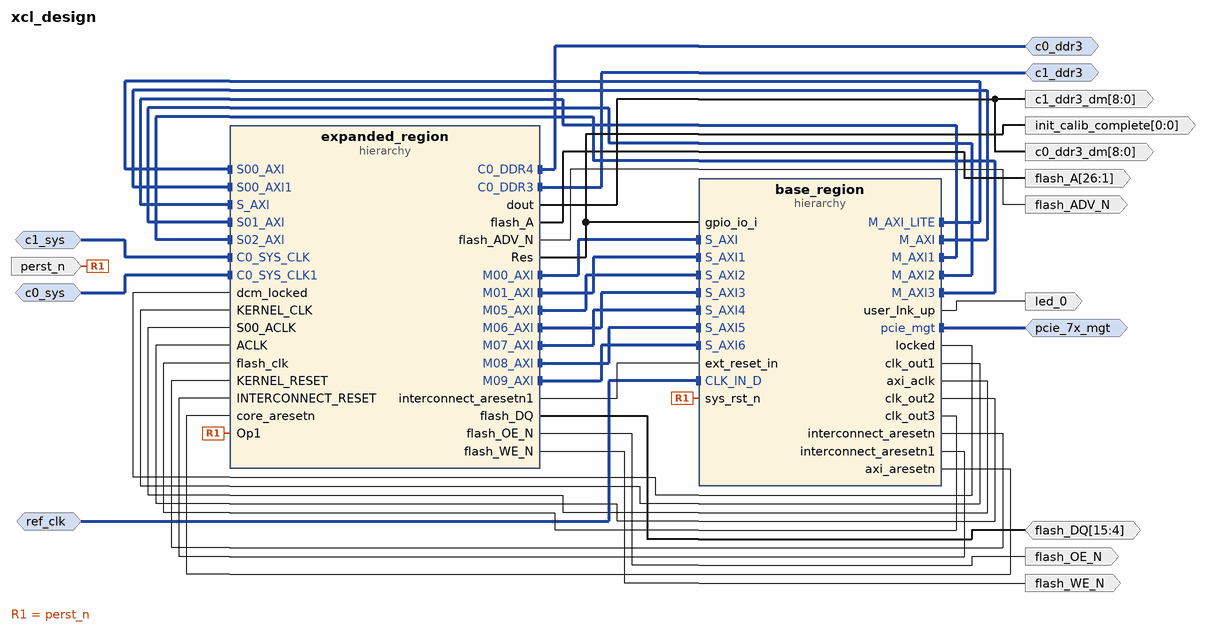
[diagram p0: block diagram of the top level]
# Vivado block design xcl_design, xcku060-ffva1156-2-e, Vivado 2016.3_sdx
create_bd_design xcl_design

create_bd_intf_port -mode Slave -vlnv xilinx.com:interface:diff_clock_rtl:1.0 ref_clk
set_property -dict {CONFIG.FREQ_HZ 100000000} [get_bd_intf_ports ref_clk]
create_bd_intf_port -mode Slave -vlnv xilinx.com:interface:diff_clock_rtl:1.0 c1_sys
set_property -dict {CONFIG.FREQ_HZ 400000000} [get_bd_intf_ports c1_sys]
create_bd_intf_port -mode Slave -vlnv xilinx.com:interface:diff_clock_rtl:1.0 c0_sys
set_property -dict {CONFIG.FREQ_HZ 400000000} [get_bd_intf_ports c0_sys]
create_bd_intf_port -mode Master -vlnv xilinx.com:interface:pcie_7x_mgt_rtl:1.0 pcie_7x_mgt
create_bd_intf_port -mode Master -vlnv xilinx.com:interface:ddrx_rtl:1.0 c1_ddr3
create_bd_intf_port -mode Master -vlnv xilinx.com:interface:ddrx_rtl:1.0 c0_ddr3
create_bd_port -dir I -type rst perst_n
set_property -dict {CONFIG.POLARITY ACTIVE_LOW} [get_bd_ports perst_n]
create_bd_port -dir O -from 8 -to 0 c1_ddr3_dm
create_bd_port -dir O -from 8 -to 0 c0_ddr3_dm
create_bd_port -dir O -from 26 -to 1 flash_A
create_bd_port -dir O flash_ADV_N
create_bd_port -dir IO -from 15 -to 4 flash_DQ
create_bd_port -dir O flash_OE_N
create_bd_port -dir O flash_WE_N
create_bd_port -dir O -from 0 -to 0 init_calib_complete
create_bd_port -dir O led_0

create_bd_cell -type hier base_region
create_bd_cell -type hier expanded_region

# ---- hierarchy /base_region ----
current_bd_instance /base_region
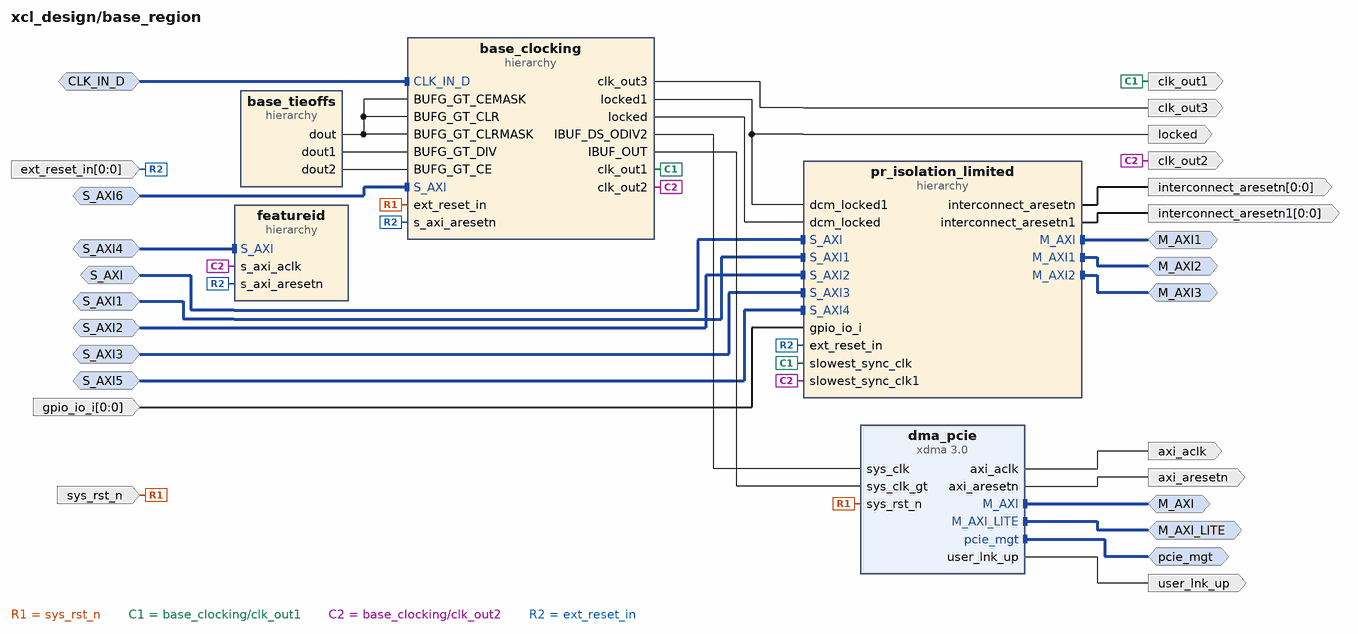
[diagram p1: block diagram inside /base_region]
create_bd_intf_pin -mode Master -vlnv xilinx.com:interface:pcie_7x_mgt_rtl:1.0 pcie_mgt
create_bd_intf_pin -mode Slave -vlnv xilinx.com:interface:diff_clock_rtl:1.0 CLK_IN_D
create_bd_intf_pin -mode Slave -vlnv xilinx.com:interface:aximm_rtl:1.0 S_AXI
create_bd_intf_pin -mode Slave -vlnv xilinx.com:interface:aximm_rtl:1.0 S_AXI1
create_bd_intf_pin -mode Master -vlnv xilinx.com:interface:aximm_rtl:1.0 M_AXI_LITE
create_bd_intf_pin -mode Master -vlnv xilinx.com:interface:aximm_rtl:1.0 M_AXI
create_bd_intf_pin -mode Master -vlnv xilinx.com:interface:aximm_rtl:1.0 M_AXI1
create_bd_intf_pin -mode Master -vlnv xilinx.com:interface:aximm_rtl:1.0 M_AXI2
create_bd_intf_pin -mode Master -vlnv xilinx.com:interface:aximm_rtl:1.0 M_AXI3
create_bd_intf_pin -mode Slave -vlnv xilinx.com:interface:aximm_rtl:1.0 S_AXI2
create_bd_intf_pin -mode Slave -vlnv xilinx.com:interface:aximm_rtl:1.0 S_AXI3
create_bd_intf_pin -mode Slave -vlnv xilinx.com:interface:aximm_rtl:1.0 S_AXI4
create_bd_intf_pin -mode Slave -vlnv xilinx.com:interface:aximm_rtl:1.0 S_AXI5
create_bd_intf_pin -mode Slave -vlnv xilinx.com:interface:aximm_rtl:1.0 S_AXI6
create_bd_pin -dir I -type rst sys_rst_n
create_bd_pin -dir O user_lnk_up
create_bd_pin -dir O locked
create_bd_pin -dir I -from 0 -to 0 gpio_io_i
create_bd_pin -dir O -type clk clk_out1
create_bd_pin -dir O -type clk axi_aclk
create_bd_pin -dir O -type clk clk_out2
create_bd_pin -dir O -type clk clk_out3
create_bd_pin -dir O -from 0 -to 0 -type rst interconnect_aresetn
create_bd_pin -dir O -from 0 -to 0 -type rst interconnect_aresetn1
create_bd_pin -dir O -type rst axi_aresetn
create_bd_pin -dir I -from 0 -to 0 -type rst ext_reset_in

create_bd_cell -type hier base_clocking
create_bd_cell -type hier featureid
create_bd_cell -type hier base_tieoffs
create_bd_cell -type hier pr_isolation_limited
create_bd_cell -type ip -vlnv xilinx.com:ip:xdma:3.0 dma_pcie
set_property -dict [list \
  CONFIG.mode_selection Advanced \
  CONFIG.pl_link_cap_max_link_width X8 \
  CONFIG.pl_link_cap_max_link_speed 8.0_GT/s \
  CONFIG.axi_data_width 256_bit \
  CONFIG.axisten_freq 250 \
  CONFIG.mcap_enablement PR_over_PCIe \
  CONFIG.pf0_device_id 8138 \
  CONFIG.pf0_subsystem_id 0231 \
  CONFIG.axilite_master_en true \
  CONFIG.axilite_master_size 4 \
  CONFIG.xdma_rnum_chnl 2 \
  CONFIG.xdma_wnum_chnl 2 \
  CONFIG.xdma_num_usr_irq 16 \
  CONFIG.cfg_mgmt_if false \
] [get_bd_cells dma_pcie]

# ---- hierarchy /base_region/base_clocking ----
current_bd_instance /base_region/base_clocking
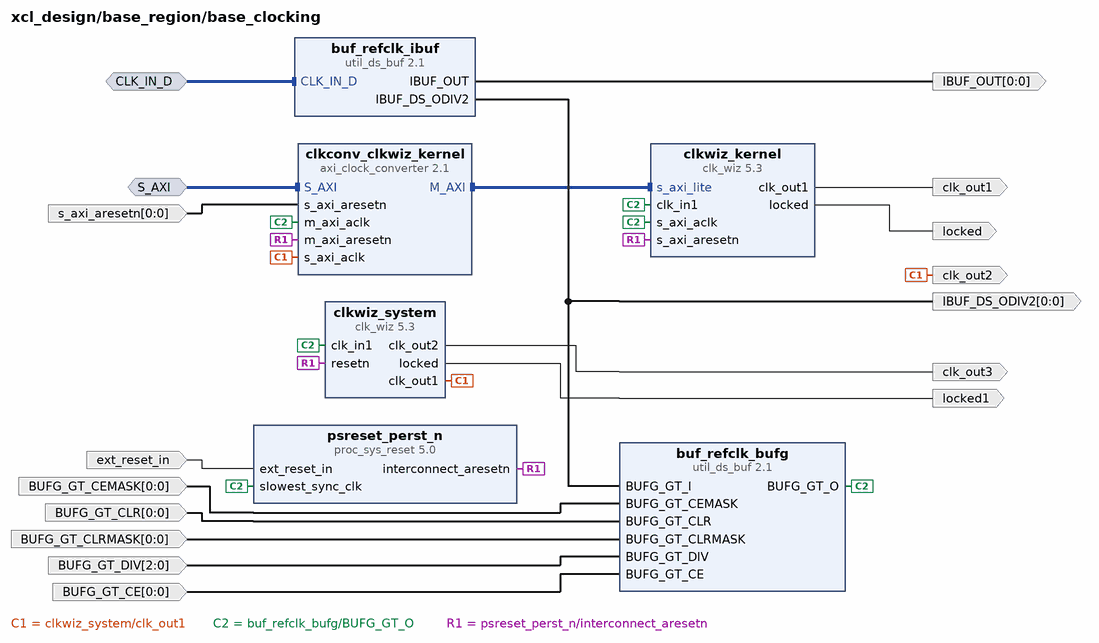
[diagram p2: block diagram inside /base_region/base_clocking]
create_bd_intf_pin -mode Slave -vlnv xilinx.com:interface:diff_clock_rtl:1.0 CLK_IN_D
create_bd_intf_pin -mode Slave -vlnv xilinx.com:interface:aximm_rtl:1.0 S_AXI
create_bd_pin -dir I -type rst ext_reset_in
create_bd_pin -dir O locked
create_bd_pin -dir O locked1
create_bd_pin -dir O -from 0 -to 0 -type clk IBUF_DS_ODIV2
create_bd_pin -dir O -from 0 -to 0 -type clk IBUF_OUT
create_bd_pin -dir I -from 0 -to 0 BUFG_GT_CEMASK
create_bd_pin -dir I -from 0 -to 0 BUFG_GT_CLR
create_bd_pin -dir I -from 0 -to 0 BUFG_GT_CLRMASK
create_bd_pin -dir I -from 2 -to 0 BUFG_GT_DIV
create_bd_pin -dir I -from 0 -to 0 BUFG_GT_CE
create_bd_pin -dir O -type clk clk_out1
create_bd_pin -dir O -type clk clk_out2
create_bd_pin -dir O -type clk clk_out3
create_bd_pin -dir I -from 0 -to 0 -type rst s_axi_aresetn

create_bd_cell -type ip -vlnv xilinx.com:ip:util_ds_buf:2.1 buf_refclk_ibuf
set_property -dict {CONFIG.C_BUF_TYPE IBUFDSGTE} [get_bd_cells buf_refclk_ibuf]
create_bd_cell -type ip -vlnv xilinx.com:ip:util_ds_buf:2.1 buf_refclk_bufg
set_property -dict {CONFIG.C_BUF_TYPE BUFG_GT} [get_bd_cells buf_refclk_bufg]
create_bd_cell -type ip -vlnv xilinx.com:ip:axi_clock_converter:2.1 clkconv_clkwiz_kernel
create_bd_cell -type ip -vlnv xilinx.com:ip:clk_wiz:5.3 clkwiz_kernel
set_property -dict {CONFIG.USE_DYN_RECONFIG true CONFIG.CLKOUT1_REQUESTED_OUT_FREQ 250.000} [get_bd_cells clkwiz_kernel]
create_bd_cell -type ip -vlnv xilinx.com:ip:clk_wiz:5.3 clkwiz_system
set_property -dict [list \
  CONFIG.CLKOUT2_USED true \
  CONFIG.CLKOUT1_REQUESTED_OUT_FREQ 200.000 \
  CONFIG.CLKOUT2_REQUESTED_OUT_FREQ 20.000 \
  CONFIG.PRIM_SOURCE Global_buffer \
  CONFIG.RESET_TYPE ACTIVE_LOW \
] [get_bd_cells clkwiz_system]
create_bd_cell -type ip -vlnv xilinx.com:ip:proc_sys_reset:5.0 psreset_perst_n
set_property -dict {CONFIG.C_AUX_RST_WIDTH 1 CONFIG.C_EXT_RST_WIDTH 1} [get_bd_cells psreset_perst_n]

# ---- hierarchy /base_region/featureid ----
current_bd_instance /base_region/featureid
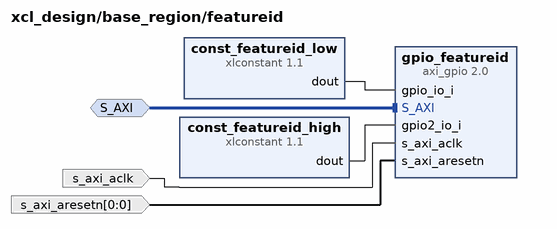
[diagram p3: block diagram inside /base_region/featureid]
create_bd_intf_pin -mode Slave -vlnv xilinx.com:interface:aximm_rtl:1.0 S_AXI
create_bd_pin -dir I -type clk s_axi_aclk
create_bd_pin -dir I -from 0 -to 0 -type rst s_axi_aresetn

create_bd_cell -type ip -vlnv xilinx.com:ip:xlconstant:1.1 const_featureid_high
set_property -dict {CONFIG.CONST_WIDTH 32 CONFIG.CONST_VAL 0} [get_bd_cells const_featureid_high]
create_bd_cell -type ip -vlnv xilinx.com:ip:xlconstant:1.1 const_featureid_low
set_property -dict {CONFIG.CONST_WIDTH 32 CONFIG.CONST_VAL 0} [get_bd_cells const_featureid_low]
create_bd_cell -type ip -vlnv xilinx.com:ip:axi_gpio:2.0 gpio_featureid
set_property -dict {CONFIG.C_IS_DUAL 1 CONFIG.C_ALL_INPUTS 1 CONFIG.C_ALL_INPUTS_2 1} [get_bd_cells gpio_featureid]

# ---- hierarchy /base_region/base_tieoffs ----
current_bd_instance /base_region/base_tieoffs
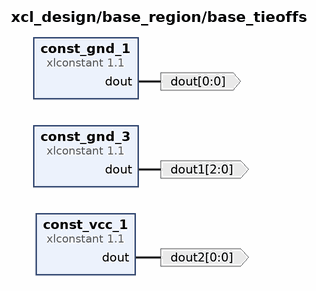
[diagram p4: block diagram inside /base_region/base_tieoffs]
create_bd_pin -dir O -from 0 -to 0 dout
create_bd_pin -dir O -from 2 -to 0 dout1
create_bd_pin -dir O -from 0 -to 0 dout2

create_bd_cell -type ip -vlnv xilinx.com:ip:xlconstant:1.1 const_gnd_1
set_property -dict {CONFIG.CONST_VAL 0} [get_bd_cells const_gnd_1]
create_bd_cell -type ip -vlnv xilinx.com:ip:xlconstant:1.1 const_gnd_3
set_property -dict {CONFIG.CONST_WIDTH 3 CONFIG.CONST_VAL 0} [get_bd_cells const_gnd_3]
create_bd_cell -type ip -vlnv xilinx.com:ip:xlconstant:1.1 const_vcc_1

# ---- hierarchy /base_region/pr_isolation_limited ----
current_bd_instance /base_region/pr_isolation_limited
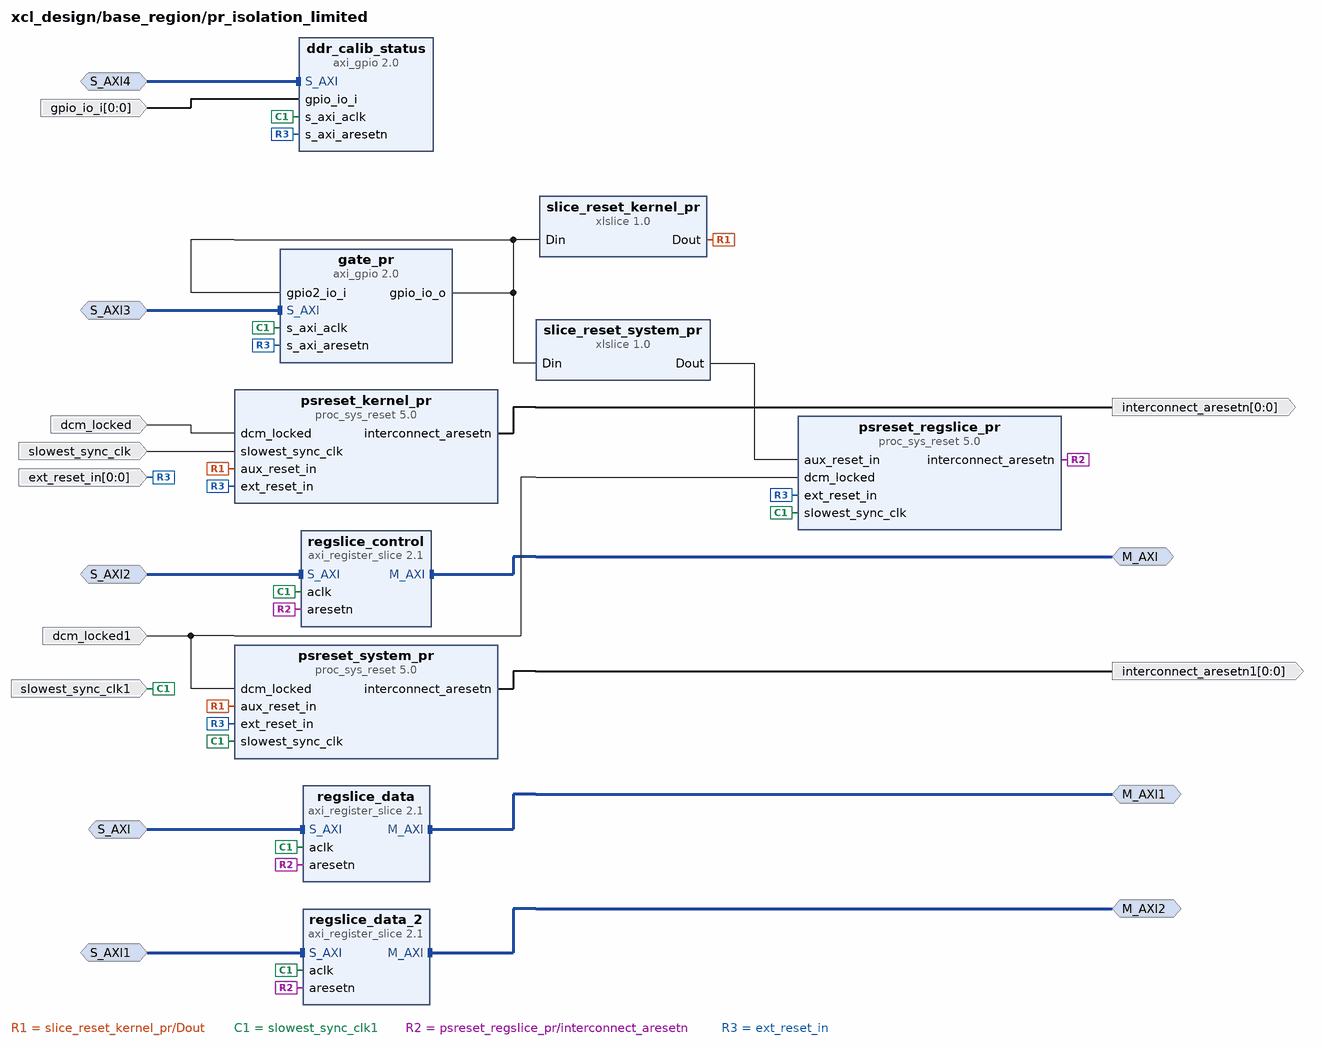
[diagram p5: block diagram inside /base_region/pr_isolation_limited]
create_bd_intf_pin -mode Slave -vlnv xilinx.com:interface:aximm_rtl:1.0 S_AXI
create_bd_intf_pin -mode Slave -vlnv xilinx.com:interface:aximm_rtl:1.0 S_AXI1
create_bd_intf_pin -mode Master -vlnv xilinx.com:interface:aximm_rtl:1.0 M_AXI
create_bd_intf_pin -mode Master -vlnv xilinx.com:interface:aximm_rtl:1.0 M_AXI1
create_bd_intf_pin -mode Master -vlnv xilinx.com:interface:aximm_rtl:1.0 M_AXI2
create_bd_intf_pin -mode Slave -vlnv xilinx.com:interface:aximm_rtl:1.0 S_AXI2
create_bd_intf_pin -mode Slave -vlnv xilinx.com:interface:aximm_rtl:1.0 S_AXI3
create_bd_intf_pin -mode Slave -vlnv xilinx.com:interface:aximm_rtl:1.0 S_AXI4
create_bd_pin -dir I dcm_locked
create_bd_pin -dir I dcm_locked1
create_bd_pin -dir I -from 0 -to 0 gpio_io_i
create_bd_pin -dir I -type clk slowest_sync_clk
create_bd_pin -dir I -type clk slowest_sync_clk1
create_bd_pin -dir O -from 0 -to 0 -type rst interconnect_aresetn
create_bd_pin -dir O -from 0 -to 0 -type rst interconnect_aresetn1
create_bd_pin -dir I -from 0 -to 0 -type rst ext_reset_in

create_bd_cell -type ip -vlnv xilinx.com:ip:xlslice:1.0 slice_reset_kernel_pr
set_property -dict {CONFIG.DIN_TO 1 CONFIG.DIN_FROM 1 CONFIG.DIN_WIDTH 2} [get_bd_cells slice_reset_kernel_pr]
create_bd_cell -type ip -vlnv xilinx.com:ip:xlslice:1.0 slice_reset_system_pr
set_property -dict {CONFIG.DIN_TO 0 CONFIG.DIN_FROM 0 CONFIG.DIN_WIDTH 2} [get_bd_cells slice_reset_system_pr]
create_bd_cell -type ip -vlnv xilinx.com:ip:axi_gpio:2.0 ddr_calib_status
set_property -dict {CONFIG.C_GPIO_WIDTH 1 CONFIG.C_ALL_INPUTS 1} [get_bd_cells ddr_calib_status]
create_bd_cell -type ip -vlnv xilinx.com:ip:axi_gpio:2.0 gate_pr
set_property -dict [list \
  CONFIG.C_GPIO_WIDTH 2 \
  CONFIG.C_GPIO2_WIDTH 2 \
  CONFIG.C_IS_DUAL 1 \
  CONFIG.C_DOUT_DEFAULT 0xFFFFFFFF \
  CONFIG.C_ALL_INPUTS_2 1 \
  CONFIG.C_ALL_OUTPUTS 1 \
] [get_bd_cells gate_pr]
create_bd_cell -type ip -vlnv xilinx.com:ip:proc_sys_reset:5.0 psreset_kernel_pr
set_property -dict {CONFIG.C_AUX_RST_WIDTH 1 CONFIG.C_EXT_RST_WIDTH 1} [get_bd_cells psreset_kernel_pr]
create_bd_cell -type ip -vlnv xilinx.com:ip:proc_sys_reset:5.0 psreset_regslice_pr
set_property -dict {CONFIG.C_AUX_RST_WIDTH 1 CONFIG.C_EXT_RST_WIDTH 1} [get_bd_cells psreset_regslice_pr]
create_bd_cell -type ip -vlnv xilinx.com:ip:proc_sys_reset:5.0 psreset_system_pr
set_property -dict {CONFIG.C_AUX_RST_WIDTH 1 CONFIG.C_EXT_RST_WIDTH 1} [get_bd_cells psreset_system_pr]
create_bd_cell -type ip -vlnv xilinx.com:ip:axi_register_slice:2.1 regslice_control
create_bd_cell -type ip -vlnv xilinx.com:ip:axi_register_slice:2.1 regslice_data
set_property -dict [list \
  CONFIG.PROTOCOL AXI4 \
  CONFIG.READ_WRITE_MODE READ_WRITE \
  CONFIG.ADDR_WIDTH 38 \
  CONFIG.DATA_WIDTH 512 \
  CONFIG.ID_WIDTH 4 \
] [get_bd_cells regslice_data]
create_bd_cell -type ip -vlnv xilinx.com:ip:axi_register_slice:2.1 regslice_data_2
set_property -dict [list \
  CONFIG.PROTOCOL AXI4 \
  CONFIG.READ_WRITE_MODE READ_WRITE \
  CONFIG.ADDR_WIDTH 38 \
  CONFIG.DATA_WIDTH 512 \
  CONFIG.ID_WIDTH 4 \
] [get_bd_cells regslice_data_2]

# ---- hierarchy /expanded_region ----
current_bd_instance /expanded_region
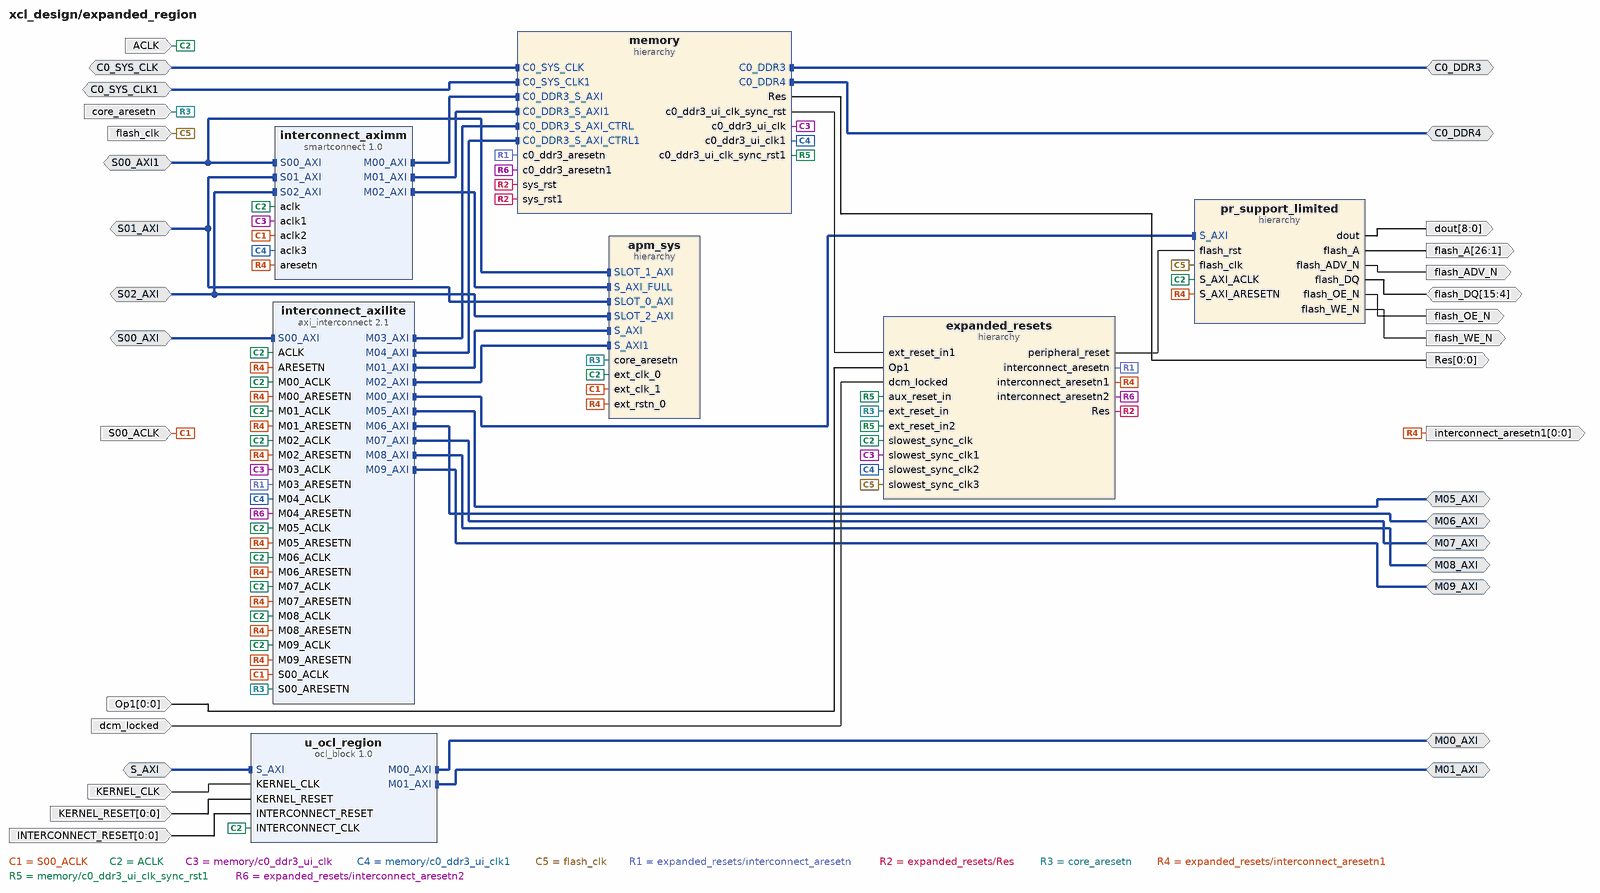
[diagram p6: block diagram inside /expanded_region]
create_bd_intf_pin -mode Slave -vlnv xilinx.com:interface:diff_clock_rtl:1.0 C0_SYS_CLK
create_bd_intf_pin -mode Master -vlnv xilinx.com:interface:ddrx_rtl:1.0 C0_DDR3
create_bd_intf_pin -mode Slave -vlnv xilinx.com:interface:diff_clock_rtl:1.0 C0_SYS_CLK1
create_bd_intf_pin -mode Master -vlnv xilinx.com:interface:ddrx_rtl:1.0 C0_DDR4
create_bd_intf_pin -mode Master -vlnv xilinx.com:interface:aximm_rtl:1.0 M00_AXI
create_bd_intf_pin -mode Master -vlnv xilinx.com:interface:aximm_rtl:1.0 M01_AXI
create_bd_intf_pin -mode Slave -vlnv xilinx.com:interface:aximm_rtl:1.0 S00_AXI
create_bd_intf_pin -mode Slave -vlnv xilinx.com:interface:aximm_rtl:1.0 S00_AXI1
create_bd_intf_pin -mode Slave -vlnv xilinx.com:interface:aximm_rtl:1.0 S_AXI
create_bd_intf_pin -mode Slave -vlnv xilinx.com:interface:aximm_rtl:1.0 S01_AXI
create_bd_intf_pin -mode Slave -vlnv xilinx.com:interface:aximm_rtl:1.0 S02_AXI
create_bd_intf_pin -mode Master -vlnv xilinx.com:interface:aximm_rtl:1.0 M05_AXI
create_bd_intf_pin -mode Master -vlnv xilinx.com:interface:aximm_rtl:1.0 M06_AXI
create_bd_intf_pin -mode Master -vlnv xilinx.com:interface:aximm_rtl:1.0 M07_AXI
create_bd_intf_pin -mode Master -vlnv xilinx.com:interface:aximm_rtl:1.0 M08_AXI
create_bd_intf_pin -mode Master -vlnv xilinx.com:interface:aximm_rtl:1.0 M09_AXI
create_bd_pin -dir I -from 0 -to 0 Op1
create_bd_pin -dir O -from 8 -to 0 dout
create_bd_pin -dir O -from 26 -to 1 flash_A
create_bd_pin -dir O flash_ADV_N
create_bd_pin -dir IO -from 15 -to 4 flash_DQ
create_bd_pin -dir O flash_OE_N
create_bd_pin -dir O flash_WE_N
create_bd_pin -dir O -from 0 -to 0 Res
create_bd_pin -dir I dcm_locked
create_bd_pin -dir I -type clk KERNEL_CLK
create_bd_pin -dir I -type clk S00_ACLK
create_bd_pin -dir I -type clk ACLK
create_bd_pin -dir I -type clk flash_clk
create_bd_pin -dir I -from 0 -to 0 -type rst KERNEL_RESET
create_bd_pin -dir I -from 0 -to 0 -type rst INTERCONNECT_RESET
create_bd_pin -dir I -type rst core_aresetn
create_bd_pin -dir O -from 0 -to 0 -type rst interconnect_aresetn1

create_bd_cell -type hier expanded_resets
create_bd_cell -type hier memory
create_bd_cell -type hier pr_support_limited
create_bd_cell -type hier apm_sys
create_bd_cell -type ip -vlnv xilinx.com:ip:axi_interconnect:2.1 interconnect_axilite
set_property -dict [list \
  CONFIG.NUM_MI 10 \
  CONFIG.M00_HAS_REGSLICE 4 \
  CONFIG.M01_HAS_REGSLICE 4 \
  CONFIG.M02_HAS_REGSLICE 4 \
  CONFIG.M03_HAS_REGSLICE 4 \
  CONFIG.M04_HAS_REGSLICE 4 \
  CONFIG.M05_HAS_REGSLICE 4 \
  CONFIG.M06_HAS_REGSLICE 4 \
  CONFIG.M07_HAS_REGSLICE 4 \
  CONFIG.M08_HAS_REGSLICE 4 \
  CONFIG.M09_HAS_REGSLICE 4 \
  CONFIG.S00_HAS_REGSLICE 4 \
] [get_bd_cells interconnect_axilite]
create_bd_cell -type ip -vlnv xilinx.com:ip:smartconnect:1.0 interconnect_aximm
set_property -dict {CONFIG.NUM_MI 3 CONFIG.NUM_SI 3 CONFIG.NUM_CLKS 4} [get_bd_cells interconnect_aximm]
create_bd_cell -type ip -vlnv xilinx.com:ip:ocl_block:1.0 u_ocl_region
set_property -dict [list \
  CONFIG.M_DATA_WIDTH 512 \
  CONFIG.M_ADDR_WIDTH 38 \
  CONFIG.M_ID_WIDTH 4 \
  CONFIG.S_ADDR_WIDTH 17 \
  CONFIG.USE_PR true \
  CONFIG.SYNC_RESET true \
  CONFIG.NUM_MI 2 \
  CONFIG.NUM_KERNELS 2 \
  CONFIG.KERNEL_TYPE ADD_ONE \
  CONFIG.HAS_KERNEL_CLOCK true \
  CONFIG.HAS_S_MEM false \
  CONFIG.NUM_M_AXIS_RX 0 \
  CONFIG.NUM_S_AXIS_TX 0 \
  CONFIG.BOUNDARY_VERSION 2 \
  CONFIG.ENABLE_SMARTCONNECT false \
  CONFIG.M_HAS_REGSLICE 4 \
  CONFIG.S_HAS_REGSLICE 4 \
] [get_bd_cells u_ocl_region]

# ---- hierarchy /expanded_region/expanded_resets ----
current_bd_instance /expanded_region/expanded_resets
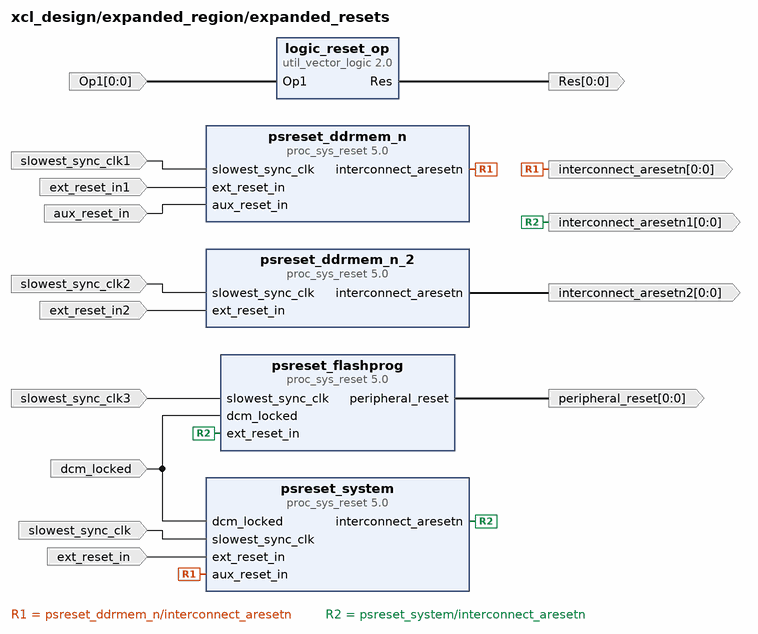
[diagram p7: block diagram inside /expanded_region/expanded_resets]
create_bd_pin -dir I -from 0 -to 0 Op1
create_bd_pin -dir I dcm_locked
create_bd_pin -dir I -type clk slowest_sync_clk
create_bd_pin -dir I -type clk slowest_sync_clk1
create_bd_pin -dir I -type clk slowest_sync_clk2
create_bd_pin -dir I -type clk slowest_sync_clk3
create_bd_pin -dir O -from 0 -to 0 -type rst interconnect_aresetn
create_bd_pin -dir O -from 0 -to 0 Res
create_bd_pin -dir I -type rst ext_reset_in
create_bd_pin -dir O -from 0 -to 0 -type rst interconnect_aresetn1
create_bd_pin -dir I -type rst ext_reset_in1
create_bd_pin -dir O -from 0 -to 0 -type rst peripheral_reset
create_bd_pin -dir I -type rst aux_reset_in
create_bd_pin -dir I -type rst ext_reset_in2
create_bd_pin -dir O -from 0 -to 0 -type rst interconnect_aresetn2

create_bd_cell -type ip -vlnv xilinx.com:ip:util_vector_logic:2.0 logic_reset_op
set_property -dict {CONFIG.C_SIZE 1 CONFIG.C_OPERATION not} [get_bd_cells logic_reset_op]
create_bd_cell -type ip -vlnv xilinx.com:ip:proc_sys_reset:5.0 psreset_ddrmem_n
create_bd_cell -type ip -vlnv xilinx.com:ip:proc_sys_reset:5.0 psreset_ddrmem_n_2
create_bd_cell -type ip -vlnv xilinx.com:ip:proc_sys_reset:5.0 psreset_flashprog
set_property -dict {CONFIG.C_AUX_RST_WIDTH 1 CONFIG.C_EXT_RST_WIDTH 1} [get_bd_cells psreset_flashprog]
create_bd_cell -type ip -vlnv xilinx.com:ip:proc_sys_reset:5.0 psreset_system
set_property -dict {CONFIG.C_AUX_RST_WIDTH 1 CONFIG.C_EXT_RST_WIDTH 1} [get_bd_cells psreset_system]

# ---- hierarchy /expanded_region/memory ----
current_bd_instance /expanded_region/memory
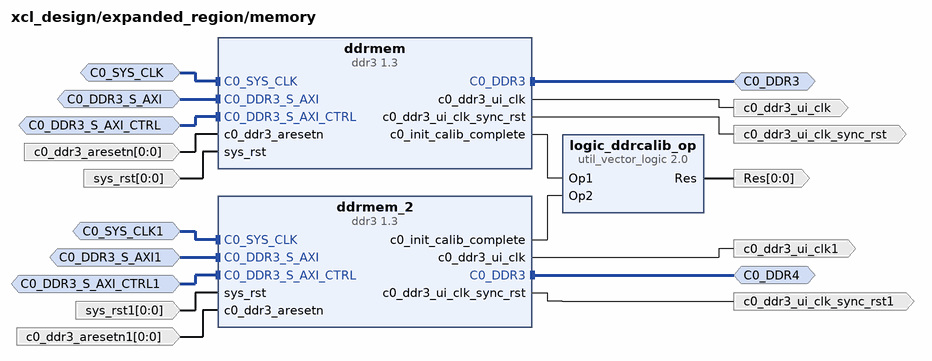
[diagram p8: block diagram inside /expanded_region/memory]
create_bd_intf_pin -mode Slave -vlnv xilinx.com:interface:diff_clock_rtl:1.0 C0_SYS_CLK
create_bd_intf_pin -mode Master -vlnv xilinx.com:interface:ddrx_rtl:1.0 C0_DDR3
create_bd_intf_pin -mode Slave -vlnv xilinx.com:interface:diff_clock_rtl:1.0 C0_SYS_CLK1
create_bd_intf_pin -mode Master -vlnv xilinx.com:interface:ddrx_rtl:1.0 C0_DDR4
create_bd_intf_pin -mode Slave -vlnv xilinx.com:interface:aximm_rtl:1.0 C0_DDR3_S_AXI
create_bd_intf_pin -mode Slave -vlnv xilinx.com:interface:aximm_rtl:1.0 C0_DDR3_S_AXI1
create_bd_intf_pin -mode Slave -vlnv xilinx.com:interface:aximm_rtl:1.0 C0_DDR3_S_AXI_CTRL
create_bd_intf_pin -mode Slave -vlnv xilinx.com:interface:aximm_rtl:1.0 C0_DDR3_S_AXI_CTRL1
create_bd_pin -dir O -from 0 -to 0 Res
create_bd_pin -dir O -type clk c0_ddr3_ui_clk
create_bd_pin -dir O -type clk c0_ddr3_ui_clk1
create_bd_pin -dir I -from 0 -to 0 -type rst c0_ddr3_aresetn
create_bd_pin -dir I -from 0 -to 0 -type rst sys_rst
create_bd_pin -dir I -from 0 -to 0 -type rst sys_rst1
create_bd_pin -dir O -type rst c0_ddr3_ui_clk_sync_rst
create_bd_pin -dir O -type rst c0_ddr3_ui_clk_sync_rst1
create_bd_pin -dir I -from 0 -to 0 -type rst c0_ddr3_aresetn1

create_bd_cell -type ip -vlnv xilinx.com:ip:util_vector_logic:2.0 logic_ddrcalib_op
set_property -dict {CONFIG.C_SIZE 1 CONFIG.C_OPERATION and} [get_bd_cells logic_ddrcalib_op]
create_bd_cell -type ip -vlnv xilinx.com:ip:ddr3:1.3 ddrmem
set_property -dict [list \
  CONFIG.C0.DDR3_TimePeriod 1250 \
  CONFIG.C0.DDR3_InputClockPeriod 2500 \
  CONFIG.C0.DDR3_MemoryType SODIMMs \
  CONFIG.C0.DDR3_MemoryPart MT18KSF1G72HZ-1G6 \
  CONFIG.C0.DDR3_DataWidth 72 \
  CONFIG.C0.DDR3_OnDieTermination RZQ/6 \
  CONFIG.C0.DDR3_CasLatency 11 \
  CONFIG.C0.DDR3_CasWriteLatency 8 \
  CONFIG.C0.DDR3_AxiDataWidth 512 \
  CONFIG.C0.DDR3_AxiAddressWidth 33 \
] [get_bd_cells ddrmem]
create_bd_cell -type ip -vlnv xilinx.com:ip:ddr3:1.3 ddrmem_2
set_property -dict [list \
  CONFIG.C0.DDR3_TimePeriod 1250 \
  CONFIG.C0.DDR3_InputClockPeriod 2500 \
  CONFIG.C0.DDR3_MemoryType SODIMMs \
  CONFIG.C0.DDR3_MemoryPart MT18KSF1G72HZ-1G6 \
  CONFIG.C0.DDR3_DataWidth 72 \
  CONFIG.C0.DDR3_OnDieTermination RZQ/6 \
  CONFIG.C0.DDR3_CasLatency 11 \
  CONFIG.C0.DDR3_CasWriteLatency 8 \
  CONFIG.C0.DDR3_AxiDataWidth 512 \
  CONFIG.C0.DDR3_AxiAddressWidth 33 \
] [get_bd_cells ddrmem_2]

# ---- hierarchy /expanded_region/pr_support_limited ----
current_bd_instance /expanded_region/pr_support_limited
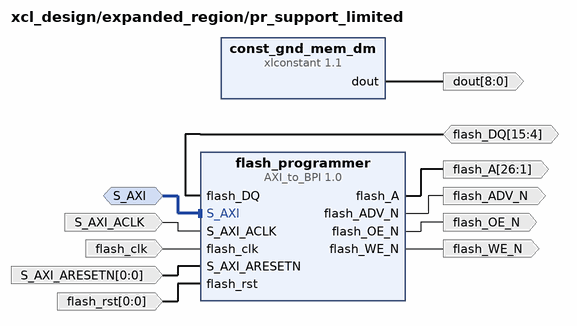
[diagram p9: block diagram inside /expanded_region/pr_support_limited]
create_bd_intf_pin -mode Slave -vlnv xilinx.com:interface:aximm_rtl:1.0 S_AXI
create_bd_pin -dir O -from 8 -to 0 dout
create_bd_pin -dir O -from 26 -to 1 flash_A
create_bd_pin -dir O flash_ADV_N
create_bd_pin -dir IO -from 15 -to 4 flash_DQ
create_bd_pin -dir O flash_OE_N
create_bd_pin -dir O flash_WE_N
create_bd_pin -dir I -type clk S_AXI_ACLK
create_bd_pin -dir I -type clk flash_clk
create_bd_pin -dir I -from 0 -to 0 -type rst S_AXI_ARESETN
create_bd_pin -dir I -from 0 -to 0 -type rst flash_rst

create_bd_cell -type ip -vlnv xilinx.com:ip:xlconstant:1.1 const_gnd_mem_dm
set_property -dict {CONFIG.CONST_WIDTH 9 CONFIG.CONST_VAL 0} [get_bd_cells const_gnd_mem_dm]
create_bd_cell -type ip -vlnv xilinx.com:user:AXI_to_BPI:1.0 flash_programmer

# ---- hierarchy /expanded_region/apm_sys ----
current_bd_instance /expanded_region/apm_sys
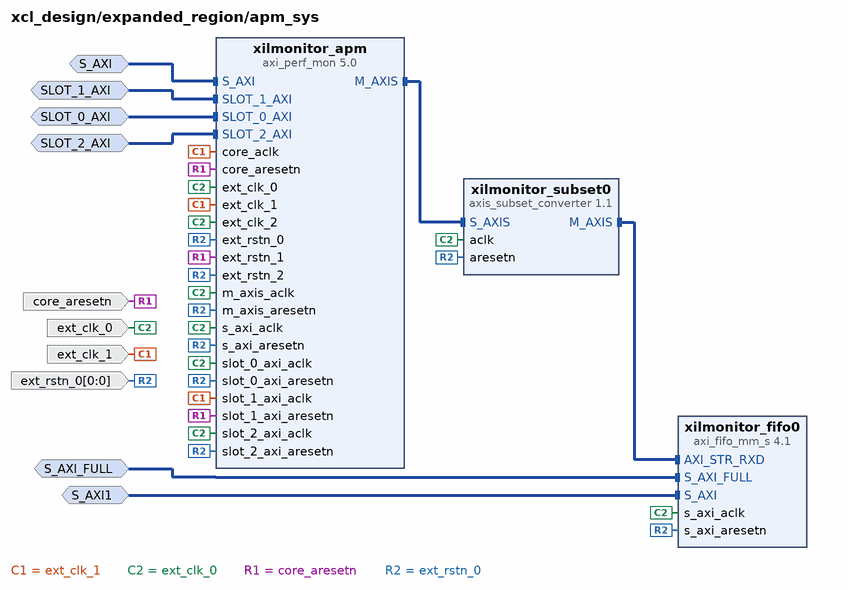
[diagram p10: block diagram inside /expanded_region/apm_sys]
create_bd_intf_pin -mode Monitor -vlnv xilinx.com:interface:aximm_rtl:1.0 SLOT_1_AXI
create_bd_intf_pin -mode Monitor -vlnv xilinx.com:interface:aximm_rtl:1.0 SLOT_0_AXI
create_bd_intf_pin -mode Monitor -vlnv xilinx.com:interface:aximm_rtl:1.0 SLOT_2_AXI
create_bd_intf_pin -mode Slave -vlnv xilinx.com:interface:aximm_rtl:1.0 S_AXI_FULL
create_bd_intf_pin -mode Slave -vlnv xilinx.com:interface:aximm_rtl:1.0 S_AXI
create_bd_intf_pin -mode Slave -vlnv xilinx.com:interface:aximm_rtl:1.0 S_AXI1
create_bd_pin -dir I -type clk ext_clk_1
create_bd_pin -dir I -type clk ext_clk_0
create_bd_pin -dir I -type rst core_aresetn
create_bd_pin -dir I -from 0 -to 0 -type rst ext_rstn_0

create_bd_cell -type ip -vlnv xilinx.com:ip:axi_perf_mon:5.0 xilmonitor_apm
set_property -dict [list \
  CONFIG.C_FIFO_AXIS_DEPTH 16 \
  CONFIG.C_REG_ALL_MONITOR_SIGNALS 1 \
  CONFIG.C_SLOT_1_AXI_ID_WIDTH 5 \
  CONFIG.C_NUM_MONITOR_SLOTS 3 \
  CONFIG.C_SHOW_AXI_IDS 0 \
  CONFIG.C_SHOW_AXI_LEN 1 \
  CONFIG.C_ENABLE_PROFILE 1 \
  CONFIG.C_ENABLE_TRACE 1 \
  CONFIG.C_EN_WR_ADD_FLAG 1 \
  CONFIG.C_EN_FIRST_WRITE_FLAG 0 \
  CONFIG.C_EN_LAST_WRITE_FLAG 1 \
  CONFIG.C_EN_RESPONSE_FLAG 0 \
  CONFIG.C_EN_RD_ADD_FLAG 1 \
  CONFIG.C_EN_FIRST_READ_FLAG 0 \
  CONFIG.C_EN_LAST_READ_FLAG 1 \
  CONFIG.C_EN_EXT_EVENTS_FLAG 1 \
  CONFIG.C_EN_SW_REG_WR_FLAG 1 \
] [get_bd_cells xilmonitor_apm]
create_bd_cell -type ip -vlnv xilinx.com:ip:axi_fifo_mm_s:4.1 xilmonitor_fifo0
set_property -dict [list \
  CONFIG.C_DATA_INTERFACE_TYPE 1 \
  CONFIG.C_RX_FIFO_PF_THRESHOLD 4091 \
  CONFIG.C_RX_FIFO_DEPTH 4096 \
  CONFIG.C_S_AXI4_DATA_WIDTH 128 \
  CONFIG.C_AXIS_TUSER_WIDTH 16 \
  CONFIG.C_USE_RX_CUT_THROUGH true \
  CONFIG.C_USE_TX_DATA 0 \
] [get_bd_cells xilmonitor_fifo0]
create_bd_cell -type ip -vlnv xilinx.com:ip:axis_subset_converter:1.1 xilmonitor_subset0
set_property -dict [list \
  CONFIG.S_TDATA_NUM_BYTES 12 \
  CONFIG.M_TDATA_NUM_BYTES 16 \
  CONFIG.TDATA_REMAP {32'b00000000000000000000000000000000,tdata[95:0]} \
] [get_bd_cells xilmonitor_subset0]

# ---- connections ----

current_bd_instance /base_region
connect_bd_intf_net [get_bd_intf_pins pcie_mgt] [get_bd_intf_pins dma_pcie/pcie_mgt]
connect_bd_intf_net [get_bd_intf_pins CLK_IN_D] [get_bd_intf_pins base_clocking/CLK_IN_D]
connect_bd_intf_net [get_bd_intf_pins S_AXI] [get_bd_intf_pins pr_isolation_limited/S_AXI]
connect_bd_intf_net -intf_net S_AXI1_1 [get_bd_intf_pins S_AXI1] [get_bd_intf_pins pr_isolation_limited/S_AXI1]
connect_bd_intf_net [get_bd_intf_pins M_AXI_LITE] [get_bd_intf_pins dma_pcie/M_AXI_LITE]
connect_bd_intf_net [get_bd_intf_pins M_AXI] [get_bd_intf_pins dma_pcie/M_AXI]
connect_bd_intf_net [get_bd_intf_pins M_AXI1] [get_bd_intf_pins pr_isolation_limited/M_AXI]
connect_bd_intf_net [get_bd_intf_pins M_AXI2] [get_bd_intf_pins pr_isolation_limited/M_AXI1]
connect_bd_intf_net [get_bd_intf_pins M_AXI3] [get_bd_intf_pins pr_isolation_limited/M_AXI2]
connect_bd_intf_net -intf_net S_AXI2_1 [get_bd_intf_pins S_AXI2] [get_bd_intf_pins pr_isolation_limited/S_AXI2]
connect_bd_intf_net -intf_net S_AXI3_1 [get_bd_intf_pins S_AXI3] [get_bd_intf_pins pr_isolation_limited/S_AXI3]
connect_bd_intf_net -intf_net S_AXI4_1 [get_bd_intf_pins S_AXI4] [get_bd_intf_pins featureid/S_AXI]
connect_bd_intf_net -intf_net S_AXI5_1 [get_bd_intf_pins S_AXI5] [get_bd_intf_pins pr_isolation_limited/S_AXI4]
connect_bd_intf_net -intf_net S_AXI6_1 [get_bd_intf_pins S_AXI6] [get_bd_intf_pins base_clocking/S_AXI]
connect_bd_net [get_bd_pins sys_rst_n] [get_bd_pins base_clocking/ext_reset_in] [get_bd_pins dma_pcie/sys_rst_n]
connect_bd_net [get_bd_pins dma_pcie/user_lnk_up] [get_bd_pins user_lnk_up]
connect_bd_net [get_bd_pins base_clocking/locked] [get_bd_pins pr_isolation_limited/dcm_locked]
connect_bd_net [get_bd_pins base_clocking/locked1] [get_bd_pins locked] [get_bd_pins pr_isolation_limited/dcm_locked1]
connect_bd_net [get_bd_pins base_clocking/IBUF_DS_ODIV2] [get_bd_pins dma_pcie/sys_clk]
connect_bd_net [get_bd_pins base_clocking/IBUF_OUT] [get_bd_pins dma_pcie/sys_clk_gt]
connect_bd_net [get_bd_pins base_tieoffs/dout] \
  [get_bd_pins base_clocking/BUFG_GT_CEMASK] [get_bd_pins base_clocking/BUFG_GT_CLR] \
  [get_bd_pins base_clocking/BUFG_GT_CLRMASK]
connect_bd_net [get_bd_pins base_tieoffs/dout1] [get_bd_pins base_clocking/BUFG_GT_DIV]
connect_bd_net [get_bd_pins base_tieoffs/dout2] [get_bd_pins base_clocking/BUFG_GT_CE]
connect_bd_net [get_bd_pins gpio_io_i] [get_bd_pins pr_isolation_limited/gpio_io_i]
connect_bd_net [get_bd_pins base_clocking/clk_out1] [get_bd_pins clk_out1] [get_bd_pins pr_isolation_limited/slowest_sync_clk]
connect_bd_net [get_bd_pins dma_pcie/axi_aclk] [get_bd_pins axi_aclk]
connect_bd_net [get_bd_pins base_clocking/clk_out2] \
  [get_bd_pins clk_out2] [get_bd_pins pr_isolation_limited/slowest_sync_clk1] [get_bd_pins featureid/s_axi_aclk]
connect_bd_net [get_bd_pins base_clocking/clk_out3] [get_bd_pins clk_out3]
connect_bd_net [get_bd_pins pr_isolation_limited/interconnect_aresetn] [get_bd_pins interconnect_aresetn]
connect_bd_net [get_bd_pins pr_isolation_limited/interconnect_aresetn1] [get_bd_pins interconnect_aresetn1]
connect_bd_net [get_bd_pins dma_pcie/axi_aresetn] [get_bd_pins axi_aresetn]
connect_bd_net [get_bd_pins ext_reset_in] \
  [get_bd_pins pr_isolation_limited/ext_reset_in] [get_bd_pins base_clocking/s_axi_aresetn] \
  [get_bd_pins featureid/s_axi_aresetn]

current_bd_instance /base_region/base_clocking
connect_bd_intf_net [get_bd_intf_pins clkconv_clkwiz_kernel/M_AXI] [get_bd_intf_pins clkwiz_kernel/s_axi_lite]
connect_bd_intf_net [get_bd_intf_pins CLK_IN_D] [get_bd_intf_pins buf_refclk_ibuf/CLK_IN_D]
connect_bd_intf_net [get_bd_intf_pins S_AXI] [get_bd_intf_pins clkconv_clkwiz_kernel/S_AXI]
connect_bd_net [get_bd_pins ext_reset_in] [get_bd_pins psreset_perst_n/ext_reset_in]
connect_bd_net [get_bd_pins clkwiz_kernel/locked] [get_bd_pins locked]
connect_bd_net [get_bd_pins clkwiz_system/locked] [get_bd_pins locked1]
connect_bd_net [get_bd_pins buf_refclk_ibuf/IBUF_DS_ODIV2] [get_bd_pins IBUF_DS_ODIV2] [get_bd_pins buf_refclk_bufg/BUFG_GT_I]
connect_bd_net [get_bd_pins buf_refclk_ibuf/IBUF_OUT] [get_bd_pins IBUF_OUT]
connect_bd_net [get_bd_pins BUFG_GT_CEMASK] [get_bd_pins buf_refclk_bufg/BUFG_GT_CEMASK]
connect_bd_net [get_bd_pins BUFG_GT_CLR] [get_bd_pins buf_refclk_bufg/BUFG_GT_CLR]
connect_bd_net [get_bd_pins BUFG_GT_CLRMASK] [get_bd_pins buf_refclk_bufg/BUFG_GT_CLRMASK]
connect_bd_net [get_bd_pins BUFG_GT_DIV] [get_bd_pins buf_refclk_bufg/BUFG_GT_DIV]
connect_bd_net [get_bd_pins BUFG_GT_CE] [get_bd_pins buf_refclk_bufg/BUFG_GT_CE]
connect_bd_net [get_bd_pins clkwiz_kernel/clk_out1] [get_bd_pins clk_out1]
connect_bd_net [get_bd_pins clkwiz_system/clk_out1] [get_bd_pins clk_out2] [get_bd_pins clkconv_clkwiz_kernel/s_axi_aclk]
connect_bd_net [get_bd_pins clkwiz_system/clk_out2] [get_bd_pins clk_out3]
connect_bd_net [get_bd_pins buf_refclk_bufg/BUFG_GT_O] \
  [get_bd_pins clkconv_clkwiz_kernel/m_axi_aclk] [get_bd_pins clkwiz_kernel/s_axi_aclk] [get_bd_pins clkwiz_kernel/clk_in1] \
  [get_bd_pins clkwiz_system/clk_in1] [get_bd_pins psreset_perst_n/slowest_sync_clk]
connect_bd_net [get_bd_pins psreset_perst_n/interconnect_aresetn] \
  [get_bd_pins clkconv_clkwiz_kernel/m_axi_aresetn] [get_bd_pins clkwiz_kernel/s_axi_aresetn] \
  [get_bd_pins clkwiz_system/resetn]
connect_bd_net [get_bd_pins s_axi_aresetn] [get_bd_pins clkconv_clkwiz_kernel/s_axi_aresetn]

current_bd_instance /base_region/featureid
connect_bd_intf_net [get_bd_intf_pins S_AXI] [get_bd_intf_pins gpio_featureid/S_AXI]
connect_bd_net [get_bd_pins const_featureid_low/dout] [get_bd_pins gpio_featureid/gpio_io_i]
connect_bd_net [get_bd_pins const_featureid_high/dout] [get_bd_pins gpio_featureid/gpio2_io_i]
connect_bd_net [get_bd_pins s_axi_aclk] [get_bd_pins gpio_featureid/s_axi_aclk]
connect_bd_net [get_bd_pins s_axi_aresetn] [get_bd_pins gpio_featureid/s_axi_aresetn]

current_bd_instance /base_region/base_tieoffs
connect_bd_net [get_bd_pins const_gnd_1/dout] [get_bd_pins dout]
connect_bd_net [get_bd_pins const_gnd_3/dout] [get_bd_pins dout1]
connect_bd_net [get_bd_pins const_vcc_1/dout] [get_bd_pins dout2]

current_bd_instance /base_region/pr_isolation_limited
connect_bd_intf_net [get_bd_intf_pins S_AXI] [get_bd_intf_pins regslice_data/S_AXI]
connect_bd_intf_net [get_bd_intf_pins S_AXI1] [get_bd_intf_pins regslice_data_2/S_AXI]
connect_bd_intf_net [get_bd_intf_pins M_AXI] [get_bd_intf_pins regslice_control/M_AXI]
connect_bd_intf_net [get_bd_intf_pins M_AXI1] [get_bd_intf_pins regslice_data/M_AXI]
connect_bd_intf_net [get_bd_intf_pins M_AXI2] [get_bd_intf_pins regslice_data_2/M_AXI]
connect_bd_intf_net [get_bd_intf_pins S_AXI2] [get_bd_intf_pins regslice_control/S_AXI]
connect_bd_intf_net [get_bd_intf_pins S_AXI3] [get_bd_intf_pins gate_pr/S_AXI]
connect_bd_intf_net [get_bd_intf_pins S_AXI4] [get_bd_intf_pins ddr_calib_status/S_AXI]
connect_bd_net [get_bd_pins gate_pr/gpio_io_o] \
  [get_bd_pins slice_reset_kernel_pr/Din] [get_bd_pins slice_reset_system_pr/Din] [get_bd_pins gate_pr/gpio2_io_i]
connect_bd_net [get_bd_pins dcm_locked] [get_bd_pins psreset_kernel_pr/dcm_locked]
connect_bd_net -net dcm_locked1_1 [get_bd_pins dcm_locked1] [get_bd_pins psreset_regslice_pr/dcm_locked] [get_bd_pins psreset_system_pr/dcm_locked]
connect_bd_net [get_bd_pins slice_reset_kernel_pr/Dout] [get_bd_pins psreset_kernel_pr/aux_reset_in] [get_bd_pins psreset_system_pr/aux_reset_in]
connect_bd_net [get_bd_pins slice_reset_system_pr/Dout] [get_bd_pins psreset_regslice_pr/aux_reset_in]
connect_bd_net [get_bd_pins gpio_io_i] [get_bd_pins ddr_calib_status/gpio_io_i]
connect_bd_net [get_bd_pins slowest_sync_clk] [get_bd_pins psreset_kernel_pr/slowest_sync_clk]
connect_bd_net -net slowest_sync_clk1_1 [get_bd_pins slowest_sync_clk1] \
  [get_bd_pins ddr_calib_status/s_axi_aclk] [get_bd_pins gate_pr/s_axi_aclk] \
  [get_bd_pins psreset_regslice_pr/slowest_sync_clk] [get_bd_pins psreset_system_pr/slowest_sync_clk] \
  [get_bd_pins regslice_control/aclk] [get_bd_pins regslice_data/aclk] [get_bd_pins regslice_data_2/aclk]
connect_bd_net [get_bd_pins psreset_kernel_pr/interconnect_aresetn] [get_bd_pins interconnect_aresetn]
connect_bd_net [get_bd_pins psreset_system_pr/interconnect_aresetn] [get_bd_pins interconnect_aresetn1]
connect_bd_net [get_bd_pins psreset_regslice_pr/interconnect_aresetn] \
  [get_bd_pins regslice_control/aresetn] [get_bd_pins regslice_data/aresetn] [get_bd_pins regslice_data_2/aresetn]
connect_bd_net [get_bd_pins ext_reset_in] \
  [get_bd_pins ddr_calib_status/s_axi_aresetn] [get_bd_pins gate_pr/s_axi_aresetn] \
  [get_bd_pins psreset_kernel_pr/ext_reset_in] [get_bd_pins psreset_regslice_pr/ext_reset_in] \
  [get_bd_pins psreset_system_pr/ext_reset_in]

current_bd_instance /expanded_region
connect_bd_intf_net [get_bd_intf_pins interconnect_aximm/M00_AXI] [get_bd_intf_pins memory/C0_DDR3_S_AXI]
connect_bd_intf_net [get_bd_intf_pins interconnect_aximm/M01_AXI] [get_bd_intf_pins memory/C0_DDR3_S_AXI1]
connect_bd_intf_net [get_bd_intf_pins interconnect_aximm/M02_AXI] [get_bd_intf_pins apm_sys/S_AXI_FULL]
connect_bd_intf_net [get_bd_intf_pins interconnect_axilite/M00_AXI] [get_bd_intf_pins pr_support_limited/S_AXI]
connect_bd_intf_net [get_bd_intf_pins interconnect_axilite/M01_AXI] [get_bd_intf_pins apm_sys/S_AXI]
connect_bd_intf_net [get_bd_intf_pins interconnect_axilite/M02_AXI] [get_bd_intf_pins apm_sys/S_AXI1]
connect_bd_intf_net [get_bd_intf_pins interconnect_axilite/M03_AXI] [get_bd_intf_pins memory/C0_DDR3_S_AXI_CTRL]
connect_bd_intf_net [get_bd_intf_pins interconnect_axilite/M04_AXI] [get_bd_intf_pins memory/C0_DDR3_S_AXI_CTRL1]
connect_bd_intf_net [get_bd_intf_pins C0_SYS_CLK] [get_bd_intf_pins memory/C0_SYS_CLK]
connect_bd_intf_net [get_bd_intf_pins C0_DDR3] [get_bd_intf_pins memory/C0_DDR3]
connect_bd_intf_net [get_bd_intf_pins C0_SYS_CLK1] [get_bd_intf_pins memory/C0_SYS_CLK1]
connect_bd_intf_net [get_bd_intf_pins C0_DDR4] [get_bd_intf_pins memory/C0_DDR4]
connect_bd_intf_net [get_bd_intf_pins M00_AXI] [get_bd_intf_pins u_ocl_region/M00_AXI]
connect_bd_intf_net [get_bd_intf_pins M01_AXI] [get_bd_intf_pins u_ocl_region/M01_AXI]
connect_bd_intf_net [get_bd_intf_pins S00_AXI] [get_bd_intf_pins interconnect_axilite/S00_AXI]
connect_bd_intf_net -intf_net S00_AXI1_1 [get_bd_intf_pins S00_AXI1] [get_bd_intf_pins interconnect_aximm/S00_AXI]
connect_bd_intf_net [get_bd_intf_pins S00_AXI1] [get_bd_intf_pins apm_sys/SLOT_1_AXI]
connect_bd_intf_net [get_bd_intf_pins S_AXI] [get_bd_intf_pins u_ocl_region/S_AXI]
connect_bd_intf_net [get_bd_intf_pins S01_AXI] [get_bd_intf_pins interconnect_aximm/S01_AXI]
connect_bd_intf_net [get_bd_intf_pins S01_AXI] [get_bd_intf_pins apm_sys/SLOT_0_AXI]
connect_bd_intf_net [get_bd_intf_pins S02_AXI] [get_bd_intf_pins interconnect_aximm/S02_AXI]
connect_bd_intf_net [get_bd_intf_pins S02_AXI] [get_bd_intf_pins apm_sys/SLOT_2_AXI]
connect_bd_intf_net [get_bd_intf_pins M05_AXI] [get_bd_intf_pins interconnect_axilite/M05_AXI]
connect_bd_intf_net [get_bd_intf_pins M06_AXI] [get_bd_intf_pins interconnect_axilite/M06_AXI]
connect_bd_intf_net [get_bd_intf_pins M07_AXI] [get_bd_intf_pins interconnect_axilite/M07_AXI]
connect_bd_intf_net [get_bd_intf_pins M08_AXI] [get_bd_intf_pins interconnect_axilite/M08_AXI]
connect_bd_intf_net [get_bd_intf_pins M09_AXI] [get_bd_intf_pins interconnect_axilite/M09_AXI]
connect_bd_net -net Op1_1 [get_bd_pins Op1] [get_bd_pins expanded_resets/Op1]
connect_bd_net [get_bd_pins pr_support_limited/dout] [get_bd_pins dout]
connect_bd_net [get_bd_pins pr_support_limited/flash_A] [get_bd_pins flash_A]
connect_bd_net [get_bd_pins pr_support_limited/flash_ADV_N] [get_bd_pins flash_ADV_N]
connect_bd_net [get_bd_pins flash_DQ] [get_bd_pins pr_support_limited/flash_DQ]
connect_bd_net [get_bd_pins pr_support_limited/flash_OE_N] [get_bd_pins flash_OE_N]
connect_bd_net [get_bd_pins pr_support_limited/flash_WE_N] [get_bd_pins flash_WE_N]
connect_bd_net [get_bd_pins memory/Res] [get_bd_pins Res]
connect_bd_net [get_bd_pins dcm_locked] [get_bd_pins expanded_resets/dcm_locked]
connect_bd_net [get_bd_pins KERNEL_CLK] [get_bd_pins u_ocl_region/KERNEL_CLK]
connect_bd_net [get_bd_pins S00_ACLK] \
  [get_bd_pins apm_sys/ext_clk_1] [get_bd_pins interconnect_axilite/S00_ACLK] [get_bd_pins interconnect_aximm/aclk2]
connect_bd_net [get_bd_pins ACLK] \
  [get_bd_pins expanded_resets/slowest_sync_clk] [get_bd_pins apm_sys/ext_clk_0] [get_bd_pins pr_support_limited/S_AXI_ACLK] \
  [get_bd_pins interconnect_axilite/ACLK] [get_bd_pins interconnect_axilite/M00_ACLK] \
  [get_bd_pins interconnect_axilite/M01_ACLK] [get_bd_pins interconnect_axilite/M02_ACLK] \
  [get_bd_pins interconnect_axilite/M05_ACLK] [get_bd_pins interconnect_axilite/M06_ACLK] \
  [get_bd_pins interconnect_axilite/M07_ACLK] [get_bd_pins interconnect_axilite/M08_ACLK] \
  [get_bd_pins interconnect_axilite/M09_ACLK] [get_bd_pins interconnect_aximm/aclk] \
  [get_bd_pins u_ocl_region/INTERCONNECT_CLK]
connect_bd_net [get_bd_pins memory/c0_ddr3_ui_clk] \
  [get_bd_pins expanded_resets/slowest_sync_clk1] [get_bd_pins interconnect_axilite/M03_ACLK] \
  [get_bd_pins interconnect_aximm/aclk1]
connect_bd_net [get_bd_pins memory/c0_ddr3_ui_clk1] \
  [get_bd_pins expanded_resets/slowest_sync_clk2] [get_bd_pins interconnect_axilite/M04_ACLK] \
  [get_bd_pins interconnect_aximm/aclk3]
connect_bd_net [get_bd_pins flash_clk] [get_bd_pins pr_support_limited/flash_clk] [get_bd_pins expanded_resets/slowest_sync_clk3]
connect_bd_net -net M03_ARESETN_1 [get_bd_pins expanded_resets/interconnect_aresetn] \
  [get_bd_pins memory/c0_ddr3_aresetn] [get_bd_pins interconnect_axilite/M03_ARESETN]
connect_bd_net [get_bd_pins expanded_resets/Res] [get_bd_pins memory/sys_rst] [get_bd_pins memory/sys_rst1]
connect_bd_net [get_bd_pins KERNEL_RESET] [get_bd_pins u_ocl_region/KERNEL_RESET]
connect_bd_net [get_bd_pins INTERCONNECT_RESET] [get_bd_pins u_ocl_region/INTERCONNECT_RESET]
connect_bd_net [get_bd_pins core_aresetn] \
  [get_bd_pins apm_sys/core_aresetn] [get_bd_pins expanded_resets/ext_reset_in] \
  [get_bd_pins interconnect_axilite/S00_ARESETN]
connect_bd_net -net ARESETN_1 [get_bd_pins expanded_resets/interconnect_aresetn1] \
  [get_bd_pins interconnect_aresetn1] [get_bd_pins apm_sys/ext_rstn_0] [get_bd_pins pr_support_limited/S_AXI_ARESETN] \
  [get_bd_pins interconnect_axilite/ARESETN] [get_bd_pins interconnect_axilite/M00_ARESETN] \
  [get_bd_pins interconnect_axilite/M01_ARESETN] [get_bd_pins interconnect_axilite/M02_ARESETN] \
  [get_bd_pins interconnect_axilite/M05_ARESETN] [get_bd_pins interconnect_axilite/M06_ARESETN] \
  [get_bd_pins interconnect_axilite/M07_ARESETN] [get_bd_pins interconnect_axilite/M08_ARESETN] \
  [get_bd_pins interconnect_axilite/M09_ARESETN] [get_bd_pins interconnect_aximm/aresetn]
connect_bd_net [get_bd_pins memory/c0_ddr3_ui_clk_sync_rst] [get_bd_pins expanded_resets/ext_reset_in1]
connect_bd_net [get_bd_pins expanded_resets/peripheral_reset] [get_bd_pins pr_support_limited/flash_rst]
connect_bd_net [get_bd_pins memory/c0_ddr3_ui_clk_sync_rst1] [get_bd_pins expanded_resets/aux_reset_in] [get_bd_pins expanded_resets/ext_reset_in2]
connect_bd_net [get_bd_pins expanded_resets/interconnect_aresetn2] \
  [get_bd_pins memory/c0_ddr3_aresetn1] [get_bd_pins interconnect_axilite/M04_ARESETN]

current_bd_instance /expanded_region/expanded_resets
connect_bd_net -net Op1_1 [get_bd_pins Op1] [get_bd_pins logic_reset_op/Op1]
connect_bd_net [get_bd_pins dcm_locked] [get_bd_pins psreset_flashprog/dcm_locked] [get_bd_pins psreset_system/dcm_locked]
connect_bd_net [get_bd_pins slowest_sync_clk] [get_bd_pins psreset_system/slowest_sync_clk]
connect_bd_net -net slowest_sync_clk1_1 [get_bd_pins slowest_sync_clk1] [get_bd_pins psreset_ddrmem_n/slowest_sync_clk]
connect_bd_net -net slowest_sync_clk2_1 [get_bd_pins slowest_sync_clk2] [get_bd_pins psreset_ddrmem_n_2/slowest_sync_clk]
connect_bd_net -net slowest_sync_clk3_1 [get_bd_pins slowest_sync_clk3] [get_bd_pins psreset_flashprog/slowest_sync_clk]
connect_bd_net [get_bd_pins psreset_ddrmem_n/interconnect_aresetn] [get_bd_pins interconnect_aresetn] [get_bd_pins psreset_system/aux_reset_in]
connect_bd_net [get_bd_pins logic_reset_op/Res] [get_bd_pins Res]
connect_bd_net [get_bd_pins ext_reset_in] [get_bd_pins psreset_system/ext_reset_in]
connect_bd_net [get_bd_pins psreset_system/interconnect_aresetn] [get_bd_pins interconnect_aresetn1] [get_bd_pins psreset_flashprog/ext_reset_in]
connect_bd_net -net ext_reset_in1_1 [get_bd_pins ext_reset_in1] [get_bd_pins psreset_ddrmem_n/ext_reset_in]
connect_bd_net [get_bd_pins psreset_flashprog/peripheral_reset] [get_bd_pins peripheral_reset]
connect_bd_net [get_bd_pins aux_reset_in] [get_bd_pins psreset_ddrmem_n/aux_reset_in]
connect_bd_net -net ext_reset_in2_1 [get_bd_pins ext_reset_in2] [get_bd_pins psreset_ddrmem_n_2/ext_reset_in]
connect_bd_net [get_bd_pins psreset_ddrmem_n_2/interconnect_aresetn] [get_bd_pins interconnect_aresetn2]

current_bd_instance /expanded_region/memory
connect_bd_intf_net [get_bd_intf_pins C0_SYS_CLK] [get_bd_intf_pins ddrmem/C0_SYS_CLK]
connect_bd_intf_net [get_bd_intf_pins C0_DDR3] [get_bd_intf_pins ddrmem/C0_DDR3]
connect_bd_intf_net [get_bd_intf_pins C0_SYS_CLK1] [get_bd_intf_pins ddrmem_2/C0_SYS_CLK]
connect_bd_intf_net [get_bd_intf_pins C0_DDR4] [get_bd_intf_pins ddrmem_2/C0_DDR3]
connect_bd_intf_net [get_bd_intf_pins C0_DDR3_S_AXI] [get_bd_intf_pins ddrmem/C0_DDR3_S_AXI]
connect_bd_intf_net [get_bd_intf_pins C0_DDR3_S_AXI1] [get_bd_intf_pins ddrmem_2/C0_DDR3_S_AXI]
connect_bd_intf_net [get_bd_intf_pins C0_DDR3_S_AXI_CTRL] [get_bd_intf_pins ddrmem/C0_DDR3_S_AXI_CTRL]
connect_bd_intf_net [get_bd_intf_pins C0_DDR3_S_AXI_CTRL1] [get_bd_intf_pins ddrmem_2/C0_DDR3_S_AXI_CTRL]
connect_bd_net [get_bd_pins logic_ddrcalib_op/Res] [get_bd_pins Res]
connect_bd_net [get_bd_pins ddrmem/c0_init_calib_complete] [get_bd_pins logic_ddrcalib_op/Op1]
connect_bd_net [get_bd_pins ddrmem_2/c0_init_calib_complete] [get_bd_pins logic_ddrcalib_op/Op2]
connect_bd_net [get_bd_pins ddrmem/c0_ddr3_ui_clk] [get_bd_pins c0_ddr3_ui_clk]
connect_bd_net [get_bd_pins ddrmem_2/c0_ddr3_ui_clk] [get_bd_pins c0_ddr3_ui_clk1]
connect_bd_net [get_bd_pins c0_ddr3_aresetn] [get_bd_pins ddrmem/c0_ddr3_aresetn]
connect_bd_net [get_bd_pins sys_rst] [get_bd_pins ddrmem/sys_rst]
connect_bd_net -net sys_rst1_1 [get_bd_pins sys_rst1] [get_bd_pins ddrmem_2/sys_rst]
connect_bd_net [get_bd_pins ddrmem/c0_ddr3_ui_clk_sync_rst] [get_bd_pins c0_ddr3_ui_clk_sync_rst]
connect_bd_net [get_bd_pins ddrmem_2/c0_ddr3_ui_clk_sync_rst] [get_bd_pins c0_ddr3_ui_clk_sync_rst1]
connect_bd_net -net c0_ddr3_aresetn1_1 [get_bd_pins c0_ddr3_aresetn1] [get_bd_pins ddrmem_2/c0_ddr3_aresetn]

current_bd_instance /expanded_region/pr_support_limited
connect_bd_intf_net [get_bd_intf_pins S_AXI] [get_bd_intf_pins flash_programmer/S_AXI]
connect_bd_net [get_bd_pins const_gnd_mem_dm/dout] [get_bd_pins dout]
connect_bd_net [get_bd_pins flash_programmer/flash_A] [get_bd_pins flash_A]
connect_bd_net [get_bd_pins flash_programmer/flash_ADV_N] [get_bd_pins flash_ADV_N]
connect_bd_net [get_bd_pins flash_DQ] [get_bd_pins flash_programmer/flash_DQ]
connect_bd_net [get_bd_pins flash_programmer/flash_OE_N] [get_bd_pins flash_OE_N]
connect_bd_net [get_bd_pins flash_programmer/flash_WE_N] [get_bd_pins flash_WE_N]
connect_bd_net [get_bd_pins S_AXI_ACLK] [get_bd_pins flash_programmer/S_AXI_ACLK]
connect_bd_net [get_bd_pins flash_clk] [get_bd_pins flash_programmer/flash_clk]
connect_bd_net [get_bd_pins S_AXI_ARESETN] [get_bd_pins flash_programmer/S_AXI_ARESETN]
connect_bd_net [get_bd_pins flash_rst] [get_bd_pins flash_programmer/flash_rst]

current_bd_instance /expanded_region/apm_sys
connect_bd_intf_net [get_bd_intf_pins xilmonitor_apm/M_AXIS] [get_bd_intf_pins xilmonitor_subset0/S_AXIS]
connect_bd_intf_net [get_bd_intf_pins xilmonitor_subset0/M_AXIS] [get_bd_intf_pins xilmonitor_fifo0/AXI_STR_RXD]
connect_bd_intf_net [get_bd_intf_pins S_AXI_FULL] [get_bd_intf_pins xilmonitor_fifo0/S_AXI_FULL]
connect_bd_intf_net [get_bd_intf_pins S_AXI] [get_bd_intf_pins xilmonitor_apm/S_AXI]
connect_bd_intf_net [get_bd_intf_pins S_AXI1] [get_bd_intf_pins xilmonitor_fifo0/S_AXI]
connect_bd_intf_net [get_bd_intf_pins SLOT_1_AXI] [get_bd_intf_pins xilmonitor_apm/SLOT_1_AXI]
connect_bd_intf_net [get_bd_intf_pins SLOT_0_AXI] [get_bd_intf_pins xilmonitor_apm/SLOT_0_AXI]
connect_bd_intf_net [get_bd_intf_pins SLOT_2_AXI] [get_bd_intf_pins xilmonitor_apm/SLOT_2_AXI]
connect_bd_net -net ext_clk_1_1 [get_bd_pins ext_clk_1] \
  [get_bd_pins xilmonitor_apm/slot_1_axi_aclk] [get_bd_pins xilmonitor_apm/ext_clk_1] [get_bd_pins xilmonitor_apm/core_aclk]
connect_bd_net -net ext_clk_0_1 [get_bd_pins ext_clk_0] \
  [get_bd_pins xilmonitor_apm/s_axi_aclk] [get_bd_pins xilmonitor_apm/slot_0_axi_aclk] \
  [get_bd_pins xilmonitor_apm/slot_2_axi_aclk] [get_bd_pins xilmonitor_apm/ext_clk_0] [get_bd_pins xilmonitor_apm/ext_clk_2] \
  [get_bd_pins xilmonitor_apm/m_axis_aclk] [get_bd_pins xilmonitor_fifo0/s_axi_aclk] [get_bd_pins xilmonitor_subset0/aclk]
connect_bd_net [get_bd_pins core_aresetn] \
  [get_bd_pins xilmonitor_apm/slot_1_axi_aresetn] [get_bd_pins xilmonitor_apm/ext_rstn_1] \
  [get_bd_pins xilmonitor_apm/core_aresetn]
connect_bd_net -net ext_rstn_0_1 [get_bd_pins ext_rstn_0] \
  [get_bd_pins xilmonitor_apm/s_axi_aresetn] [get_bd_pins xilmonitor_apm/slot_0_axi_aresetn] \
  [get_bd_pins xilmonitor_apm/slot_2_axi_aresetn] [get_bd_pins xilmonitor_apm/ext_rstn_0] \
  [get_bd_pins xilmonitor_apm/ext_rstn_2] [get_bd_pins xilmonitor_apm/m_axis_aresetn] \
  [get_bd_pins xilmonitor_fifo0/s_axi_aresetn] [get_bd_pins xilmonitor_subset0/aresetn]
